# EasyEDA schematic 立创EDA.json
TITLE: Sheet_1; REV: 1.0; Date: 2022-03-10; Sheet: 1/1; Company: Your Company
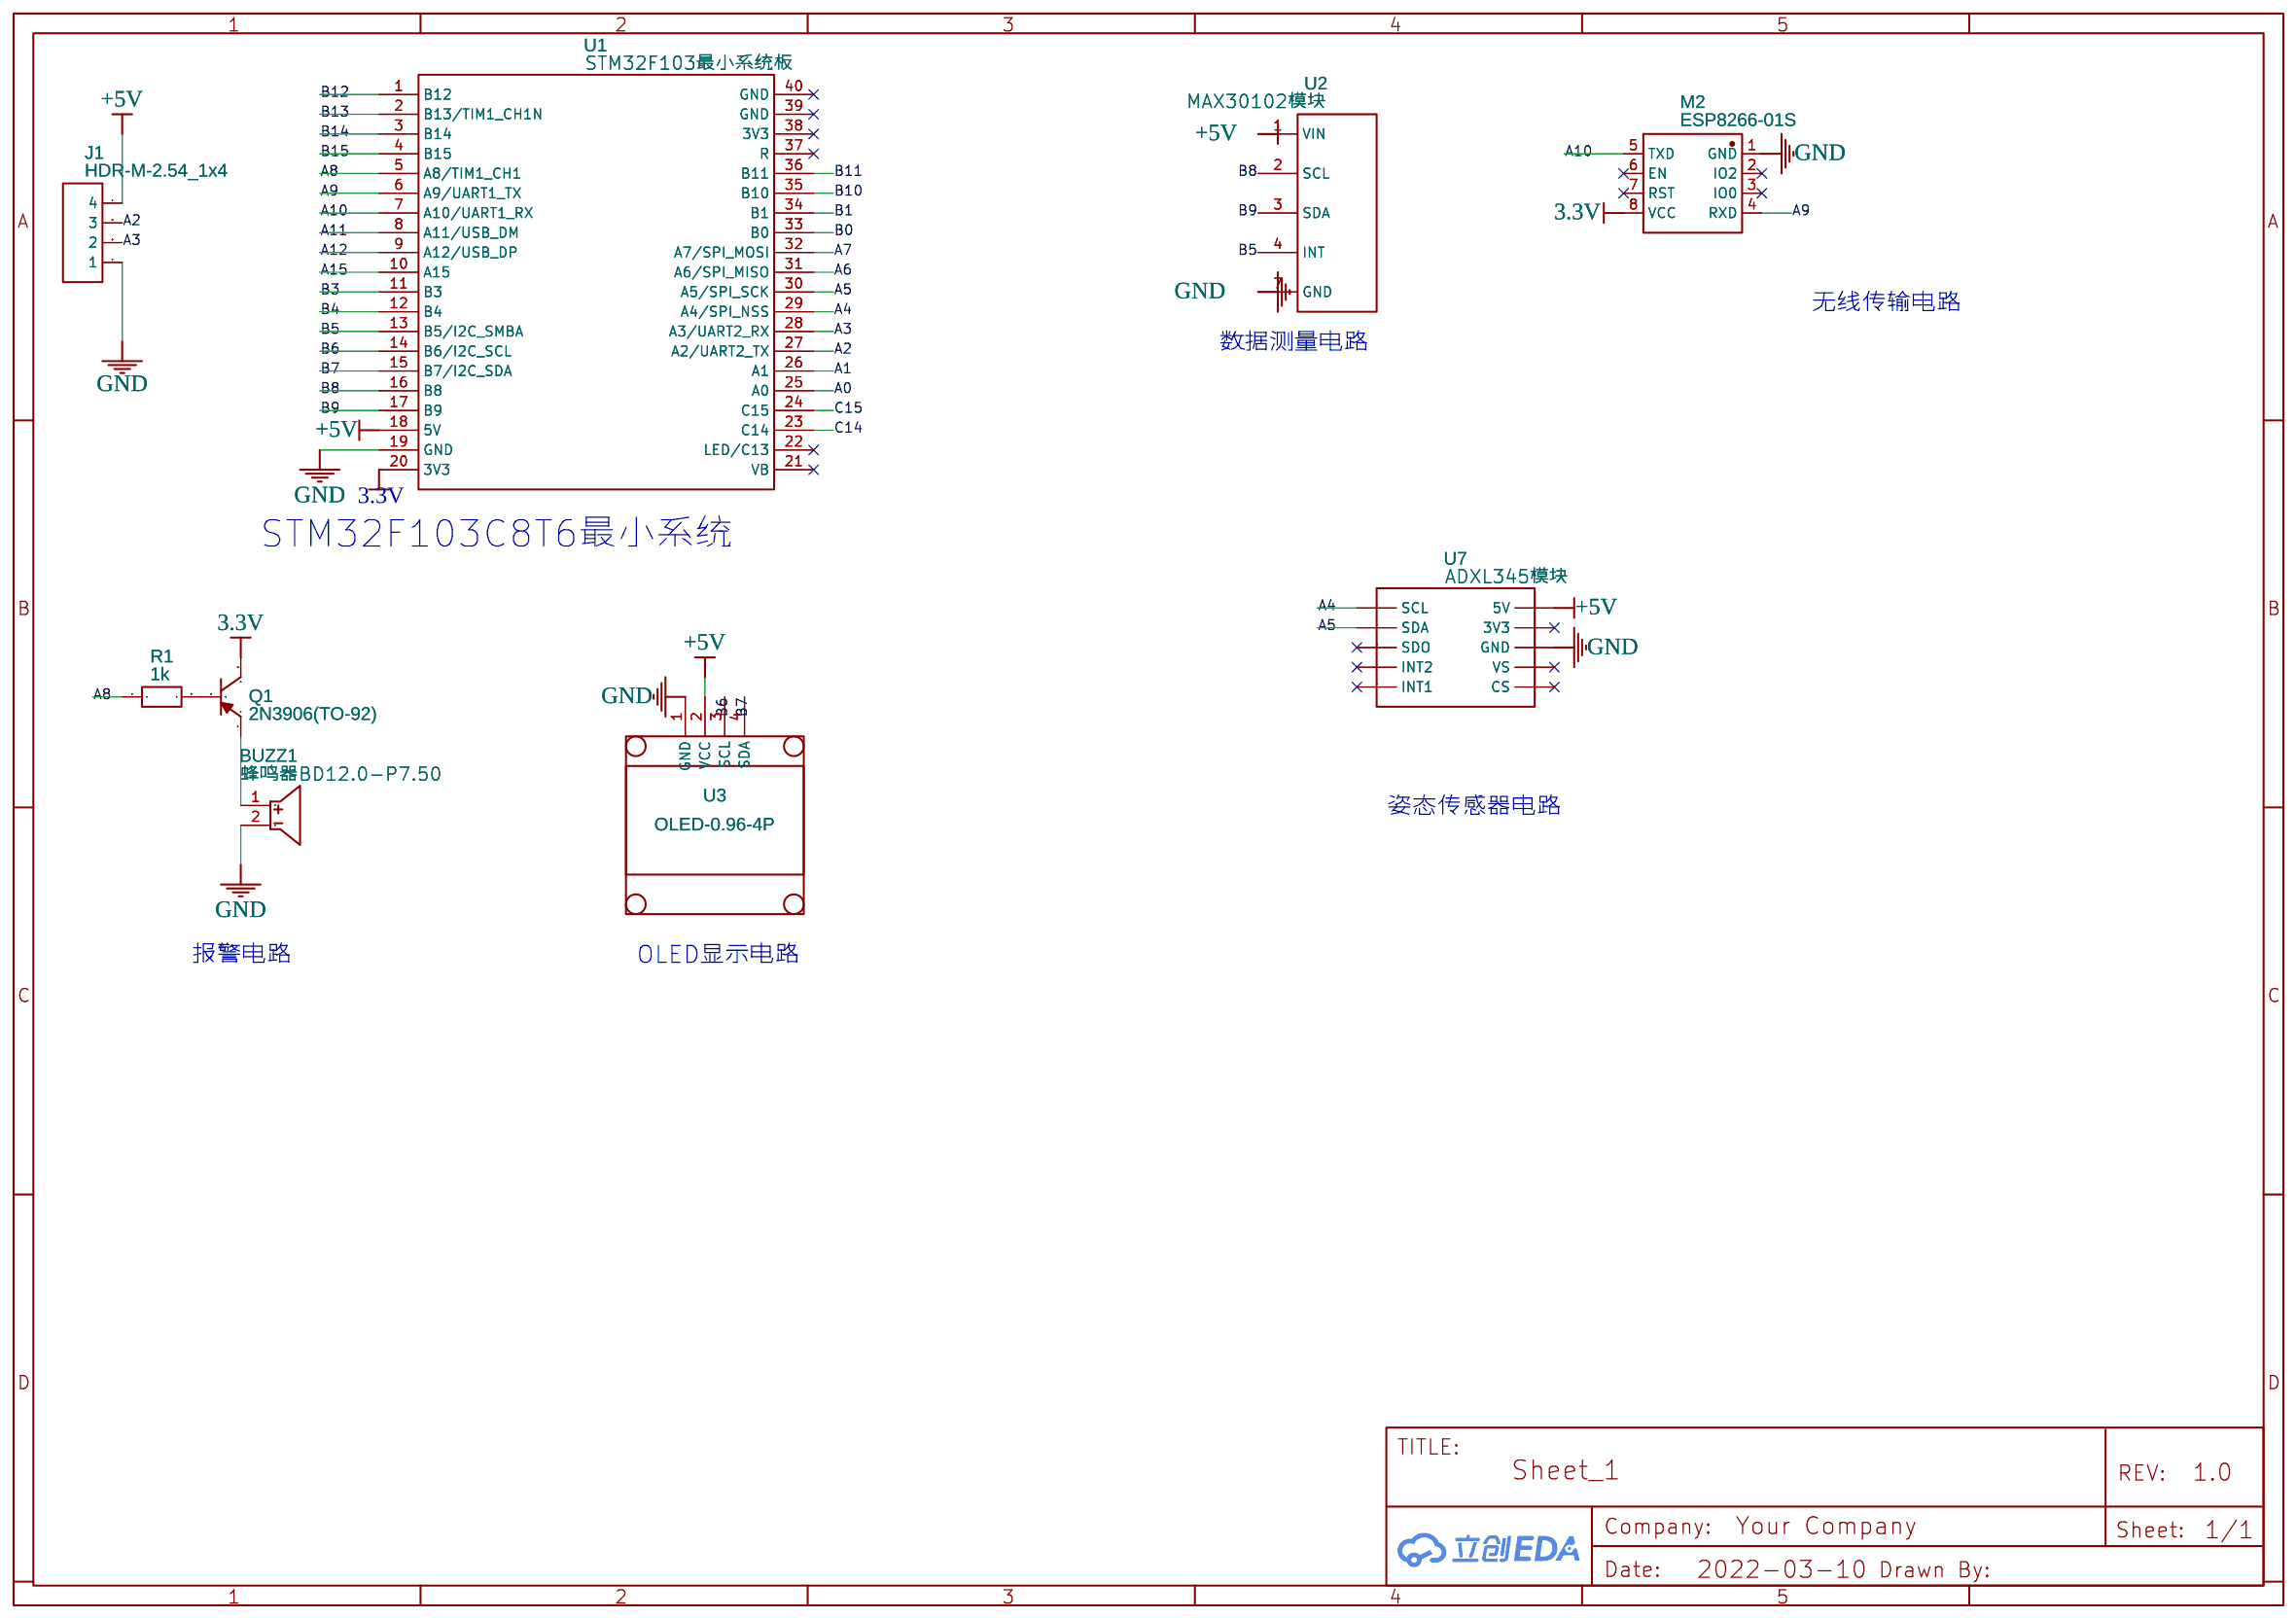
[diagram p0: schematic sheet]

## Parts
BUZZ1  蜂鸣器BD12.0-P7.50  [BUZ-TH_BD12.0-P7.50-D0.6-FD]
J1  HDR-M-2.54_1x4  [HDR-M-2.54_1X4]
M2  ESP8266-01S  [ESP8266-01S_DIP8]
Q1  2N3906(TO-92)  [TO-92-3_L4.9-W3.7-P1.27-L]
R1  1k  [R_AXIAL-0.3]
U1  STM32F103最小系统板  [STM32F103最小系统板]
U2  MAX30102模块  [MAX30102模块]
U3  OLED-0.96-4P  [OLED-9.6-4P]
U7  ADXL345模块  [ADXL345模块]

## Library data of the parts
BUZZ1 = 蜂鸣器BD12.0-P7.50: Supplier: LCSC; Supplier Part: C9900003117; Manufacturer: null; Contributor: LCSC; JLCPCB Part Class: Extended Part
J1 = HDR-M-2.54_1x4: Supplier Part: C124378; Supplier: LCSC; Contributor: LCEDA_Lib
M2 = ESP8266-01S: Contributor: lmfyy1314
Q1 = 2N3906(TO-92): Supplier: LCSC; Manufacturer: CJ; Manufacturer Part: 2N3906; Supplier Part: C9809; Contributor: LCEDA_Lib
R1 = R_AXIAL-0.3_EU: Contributor: LCEDA_Lib
U1 = STM32F103最小系统板: Contributor: largestbrush
U2 = MAX30102模块: Contributor: TanAifeng
U3 = OLED-0.96-4P: Manufacturer Part: oled-0.96-4p-spi; Supplier Part: undefined; Contributor: gnawnij
U7 = ADXL345模块: Contributor: hengyong

## Nets
3.3V: M2.8(VCC) Q1.3(C) U1.20(3V3)
+5V: J1.4 U1.18(5V) U2.1(VIN) U3.2(VCC) U7.10(5V)
GND: BUZZ1.2 J1.1 M2.1(GND) U1.19(GND) U2.7(GND) U3.1(GND) U7.8(GND)
A0: U1.25(A0)
A1: U1.26(A1)
A2: J1.3 U1.27(A2/UART2_TX)
A3: J1.2 U1.28(A3/UART2_RX)
A4: U1.29(A4/SPI_NSS) U7.1(SCL)
A5: U1.30(A5/SPI_SCK) U7.2(SDA)
A6: U1.31(A6/SPI_MISO)
A7: U1.32(A7/SPI_MOSI)
A8: R1.1 U1.5(A8/TIM1_CH1)
A9: M2.4(RXD) U1.6(A9/UART1_TX)
A10: M2.5(TXD) U1.7(A10/UART1_RX)
A11: U1.8(A11/USB_DM)
A12: U1.9(A12/USB_DP)
A15: U1.10(A15)
B0: U1.33(B0)
B1: U1.34(B1)
B3: U1.11(B3)
B4: U1.12(B4)
B5: U1.13(B5/I2C_SMBA) U2.4(INT)
B6: U1.14(B6/I2C_SCL) U3.3(SCL)
B7: U1.15(B7/I2C_SDA) U3.4(SDA)
B8: U1.16(B8) U2.2(SCL)
B9: U1.17(B9) U2.3(SDA)
B10: U1.35(B10)
B11: U1.36(B11)
B12: U1.1(B12)
B13: U1.2(B13/TIM1_CH1N)
B14: U1.3(B14)
B15: U1.4(B15)
C14: U1.23(C14)
C15: U1.24(C15)
Net-(BUZZ1-1): BUZZ1.1 Q1.1(E)
Net-(Q1-2): Q1.2(B) R1.2

Not connected (* = marked no-connect by the designer): M2 2(IO2)* 3(IO0)* 6(EN)* 7(RST)*; U1 21(VB)* 22(LED/C13)* 37(R)* 38(3V3)* 39(GND)* 40(GND)*; U7 3(SDO)* 4(INT2)* 5(INT1)* 6(CS)* 7(VS)* 9(3V3)*

## Notes on the sheet
- 无线传输电路
- 数据测量电路
- STM32F103C8T6最小系统
- 姿态传感器电路
- 报警电路
- OLED显示电路
